# Altium schematic sheet Configure, ICE, Reset.SchDoc
size 220 x 165 mm
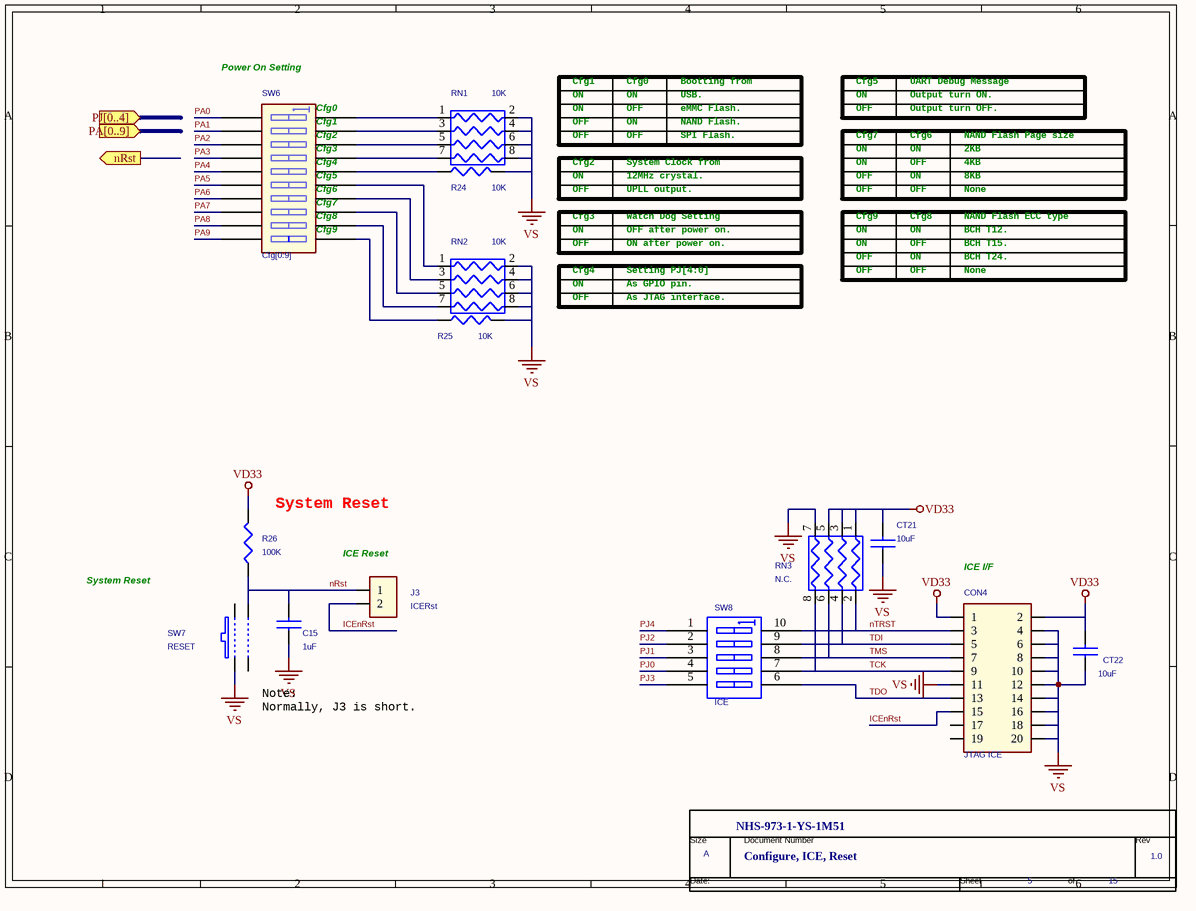
[diagram p0: Configure, ICE, Reset.SchDoc]

## Parts
*  RevCode: 1.0  Page Size: A  Page Number: 5  Page Count: 15  Doc: Configure, ICE, Reset  OrgName: NHS-973-1-YS-1M51  (hidden comment: TitleBlock0N)  (graphical)
C15  1uF  [C0603]
CON4  JTAG ICE  [HEADER10X2\BOX]
CT21  10uF  [C0603]
CT22  10uF  [C0603]
J3  ICERst  [Header_2x1_2.54mm]
R24  10K  [R0603]
R25  10K  [R0603]
R26  100K  [R0603]
RN1  10K  [8P4RA]
RN2  10K  [8P4RA]
RN3  N.C.  [8P4RA]
SW6  Cfg[0:9]  [DIPSWX10_2.54mm]
SW7  RESET  [STS-B5]
SW8  ICE  [DIPSWx5_2.54mm]

## Ports
nRst (out), PA[0..9] (in), PJ[0..4] (in)

## Nets
VD33: CON4.1 CON4.2 CT21.2 CT22.2 R26.1 RN3.1(R1) RN3.3(R2) RN3.5(R3)
VS: C15.1 CON4.4 CON4.6 CON4.8 CON4.10 CON4.11 CON4.12 CON4.14 CON4.16 CON4.18 CON4.20 CT21.1 CT22.1 R24.2 R25.2 RN1.2(R1) RN1.4(R2) RN1.6(R3) RN1.8(R4) RN2.2(R1) RN2.4(R2) RN2.6(R3) RN2.8(R4) RN3.7(R4) SW7.4
ICEnRst: CON4.15 J3.2
nRst: C15.2 J3.1 R26.2 SW7.1
nTRST: CON4.3 RN3.2(R1) SW8.10(B1)
PA0: SW6.1(A1)
PA1: SW6.2(A2)
PA2: SW6.3(A3)
PA3: SW6.4(A4)
PA4: SW6.5(A5)
PA5: SW6.6(A6)
PA6: SW6.7(A7)
PA7: SW6.8(A8)
PA8: SW6.9(A9)
PA9: SW6.10(A10)
PJ0: SW8.4(A4)
PJ1: SW8.3(A3)
PJ2: SW8.2(A2)
PJ3: SW8.5(A5)
PJ4: SW8.1(A1)
TCK: CON4.9 RN3.8(R4) SW8.7(B4)
TDI: CON4.5 RN3.4(R2) SW8.9(B2)
TDO: CON4.13 SW8.6(B5)
TMS: CON4.7 RN3.6(R3) SW8.8(B3)
NetR24_1: R24.1 SW6.16(B5)
NetR25_1: R25.1 SW6.11(B10)
NetRN1_1: RN1.1(R1) SW6.20(B1)
NetRN1_3: RN1.3(R2) SW6.19(B2)
NetRN1_5: RN1.5(R3) SW6.18(B3)
NetRN1_7: RN1.7(R4) SW6.17(B4)
NetRN2_1: RN2.1(R1) SW6.15(B6)
NetRN2_3: RN2.3(R2) SW6.14(B7)
NetRN2_5: RN2.5(R3) SW6.13(B8)
NetRN2_7: RN2.7(R4) SW6.12(B9)

Not connected (* = marked no-connect by the designer): CON4 17 19; SW7 2 3

## Notes on the sheet
- (near SW6) Power On Setting
- Cfg1
- ON
- Cfg0
- USB.
- Bootting from
- Cfg5
- UART Debug Message
- Output turn ON.
- (near SW6) Cfg0
- (near SW6) Cfg1
- (near SW6) Cfg2
- (near SW6) Cfg3
- (near SW6) Cfg4
- OFF
- Cfg2
- System Clock from
- SPI Flash.
- eMMC Flash.
- NAND Flash.
- Cfg7
- Output turn OFF.
- Cfg6
- 2KB
- NAND Flash Page size
- 4KB
- (near SW6) Cfg5
- (near SW6) Cfg6
- (near SW6) Cfg7
- (near SW6) Cfg8
- (near SW6) Cfg9
- Cfg3
- 12MHz crystal.
- UPLL output.
- OFF after power on.
- Watch Dog Setting
- Cfg9
- Cfg8
- None
- 8KB
- BCH T12.
- NAND Flash ECC type
- Cfg4
- ON after power on.
- As GPIO pin.
- Setting PJ[4:0]
- As JTAG interface.
- BCH T15.
- BCH T24.
- (near R26) System Reset
- (near J3) ICE Reset
- (near CON4) ICE I/F
- System Reset
- (near SW7) Note:
  Normally, J3 is short.
- (in symbol TitleBlock0N) Size; Document Number; Rev; Date:; Sheet; of

## Library data of the parts
C15 CT21 CT22 = CAP NP
CON4 = HEADER 2X20_0: Package: HEADER10X2
J3 = CON2
R24-R26 = R
RN1-RN3 = R-PACK8_0: Package: 8P4RA
SW6 = SW DIP-10
SW7 = SW-S
SW8 = SW DIP-5
* = TitleBlock0N: Page Create Date: April 25, 1995